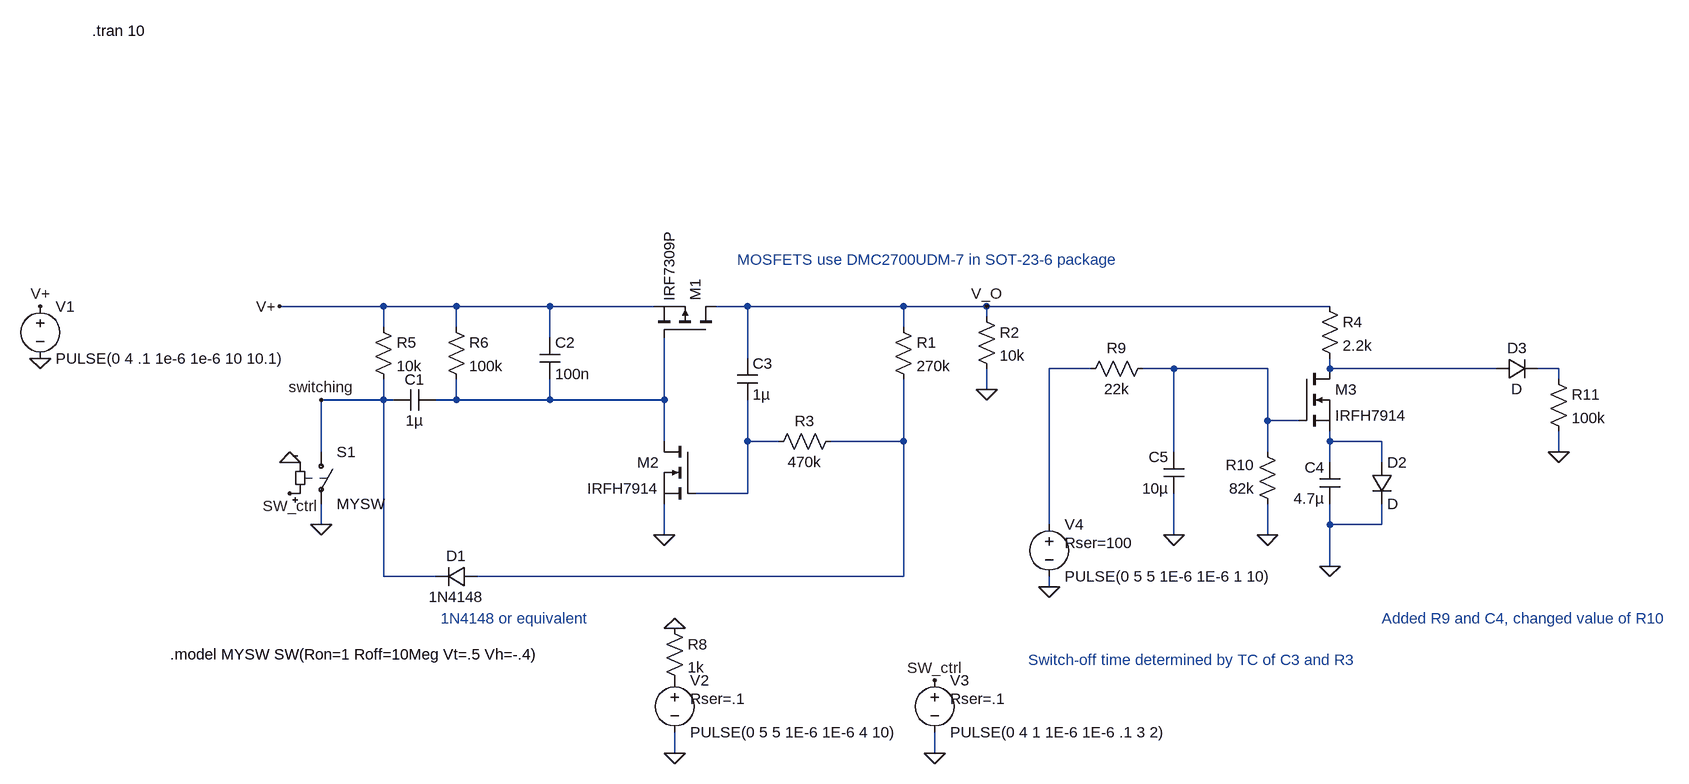
[diagram p0: schematic on_button_timing.asc]
on_button_timing.asc, the LTspice schematic file:
Version 4
SHEET 1 2168 680
WIRE 112 -576 -48 -576
WIRE 224 -576 112 -576
WIRE 368 -576 224 -576
WIRE 528 -576 368 -576
WIRE 672 -576 624 -576
WIRE 912 -576 672 -576
WIRE 1040 -576 912 -576
WIRE 1568 -576 1040 -576
WIRE 1040 -560 1040 -576
WIRE 112 -544 112 -576
WIRE 224 -544 224 -576
WIRE 912 -544 912 -576
WIRE 368 -528 368 -576
WIRE 672 -496 672 -576
WIRE 1200 -480 1136 -480
WIRE 1328 -480 1280 -480
WIRE 1472 -480 1328 -480
WIRE 1568 -480 1568 -496
WIRE 1824 -480 1568 -480
WIRE 1920 -480 1888 -480
WIRE 1920 -464 1920 -480
WIRE 1040 -448 1040 -480
WIRE 112 -432 112 -464
WIRE 112 -432 16 -432
WIRE 128 -432 112 -432
WIRE 224 -432 224 -464
WIRE 224 -432 192 -432
WIRE 368 -432 368 -464
WIRE 368 -432 224 -432
WIRE 544 -432 544 -528
WIRE 544 -432 368 -432
WIRE 1472 -400 1472 -480
WIRE 1520 -400 1472 -400
WIRE 544 -368 544 -432
WIRE 672 -368 672 -432
WIRE 720 -368 672 -368
WIRE 912 -368 912 -464
WIRE 912 -368 800 -368
WIRE 1568 -368 1568 -384
WIRE 1648 -368 1568 -368
WIRE 16 -352 16 -432
WIRE 1328 -352 1328 -480
WIRE 1472 -352 1472 -400
WIRE 1920 -352 1920 -384
WIRE 1568 -336 1568 -368
WIRE 1648 -336 1648 -368
WIRE 672 -288 672 -368
WIRE 672 -288 592 -288
WIRE 16 -240 16 -272
WIRE 1136 -240 1136 -480
WIRE 1568 -240 1568 -272
WIRE 1648 -240 1648 -272
WIRE 1648 -240 1568 -240
WIRE 544 -224 544 -272
WIRE 1328 -224 1328 -288
WIRE 1472 -224 1472 -272
WIRE 1568 -176 1568 -240
WIRE 112 -160 112 -432
WIRE 192 -160 112 -160
WIRE 912 -160 912 -368
WIRE 912 -160 256 -160
WIRE 1136 -144 1136 -160
WIRE 560 112 560 80
WIRE 960 112 960 80
FLAG 544 -224 0
FLAG -48 -576 V+
FLAG 1040 -576 V_O
FLAG 960 112 0
FLAG -416 -496 0
FLAG -416 -576 V+
FLAG 960 0 SW_ctrl
FLAG -32 -288 SW_ctrl
FLAG 1040 -448 0
FLAG -32 -336 0
FLAG 16 -240 0
FLAG 560 112 0
FLAG 16 -432 switching
FLAG 1568 -176 0
FLAG 1136 -144 0
FLAG 560 -80 0
FLAG 1472 -224 0
FLAG 1328 -224 0
FLAG 1920 -352 0
SYMBOL voltage 960 -16 R0
WINDOW 123 0 0 Left 2
WINDOW 39 24 44 Left 2
SYMATTR SpiceLine Rser=.1
SYMATTR InstName V3
SYMATTR Value PULSE(0 4 1 1E-6 1E-6 .1 3 2)
SYMBOL res 96 -560 R0
SYMATTR InstName R5
SYMATTR Value 10k
SYMBOL res 208 -560 R0
SYMATTR InstName R6
SYMATTR Value 100k
SYMBOL pmos 624 -528 M270
SYMATTR InstName M1
SYMATTR Value IRF7309P
SYMBOL nmos 592 -368 M0
SYMATTR InstName M2
SYMATTR Value IRFH7914
SYMBOL sw 16 -368 R0
SYMATTR InstName S1
SYMATTR Value MYSW
SYMBOL voltage -416 -592 R0
WINDOW 123 0 0 Left 2
WINDOW 39 0 0 Left 2
SYMATTR InstName V1
SYMATTR Value PULSE(0 4 .1 1e-6 1e-6 10 10.1)
SYMBOL res 896 -560 R0
SYMATTR InstName R1
SYMATTR Value 270k
SYMBOL cap 352 -528 R0
SYMATTR InstName C2
SYMATTR Value 100n
SYMBOL cap 192 -448 R90
WINDOW 0 0 32 VBottom 2
WINDOW 3 32 32 VTop 2
SYMATTR InstName C1
SYMATTR Value 1µ
SYMBOL cap 656 -496 R0
SYMATTR InstName C3
SYMATTR Value 1µ
SYMBOL res 816 -384 R90
WINDOW 0 0 56 VBottom 2
WINDOW 3 32 56 VTop 2
SYMATTR InstName R3
SYMATTR Value 470k
SYMBOL diode 256 -176 R90
WINDOW 0 0 32 VBottom 2
WINDOW 3 32 32 VTop 2
SYMATTR InstName D1
SYMATTR Value 1N4148
SYMBOL voltage 560 -16 R0
WINDOW 123 0 0 Left 2
WINDOW 39 24 44 Left 2
SYMATTR SpiceLine Rser=.1
SYMATTR InstName V2
SYMATTR Value PULSE(0 5 5 1E-6 1E-6 4 10)
SYMBOL nmos 1520 -480 R0
SYMATTR InstName M3
SYMATTR Value IRFH7914
SYMBOL res 1552 -592 R0
SYMATTR InstName R4
SYMATTR Value 2.2k
SYMBOL voltage 1136 -256 R0
WINDOW 123 0 0 Left 2
WINDOW 39 24 44 Left 2
SYMATTR SpiceLine Rser=100
SYMATTR InstName V4
SYMATTR Value PULSE(0 5 5 1E-6 1E-6 1 10)
SYMBOL res 544 -96 R0
SYMATTR InstName R8
SYMATTR Value 1k
SYMBOL res 1024 -576 R0
SYMATTR InstName R2
SYMATTR Value 10k
SYMBOL res 1488 -256 R180
WINDOW 0 36 76 Left 2
WINDOW 3 36 40 Left 2
SYMATTR InstName R10
SYMATTR Value 82k
SYMBOL cap 1584 -272 R180
WINDOW 0 24 56 Left 2
WINDOW 3 24 8 Left 2
SYMATTR InstName C4
SYMATTR Value 4.7µ
SYMBOL res 1296 -496 R90
WINDOW 0 0 56 VBottom 2
WINDOW 3 32 56 VTop 2
SYMATTR InstName R9
SYMATTR Value 22k
SYMBOL diode 1632 -336 R0
SYMATTR InstName D2
SYMBOL cap 1344 -288 R180
WINDOW 0 24 56 Left 2
WINDOW 3 24 8 Left 2
SYMATTR InstName C5
SYMATTR Value 10µ
SYMBOL diode 1824 -464 R270
WINDOW 0 32 32 VTop 2
WINDOW 3 0 32 VBottom 2
SYMATTR InstName D3
SYMBOL res 1904 -480 R0
SYMATTR InstName R11
SYMATTR Value 100k
TEXT -336 -1000 Left 2 !.tran 10
TEXT -216 -40 Left 2 !.model MYSW SW(Ron=1 Roff=10Meg Vt=.5 Vh=-.4)
TEXT 656 -648 Left 2 ;MOSFETS use DMC2700UDM-7 in SOT-23-6 package
TEXT 1104 -32 Left 2 ;Switch-off time determined by TC of C3 and R3
TEXT 200 -96 Left 2 ;1N4148 or equivalent
TEXT 1648 -96 Left 2 ;Added R9 and C4, changed value of R10

The netlist it stands for:
* on_button_timing.asc
V3 SW_ctrl 0 PULSE(0 4 1 1E-6 1E-6 .1 3 2) Rser=.1
R5 V+ switching 10k
R6 V+ N005 100k
M1 V_O N005 V+ V+ IRF7309P
M2 N005 N006 0 0 IRFH7914
S1 switching 0 SW_ctrl 0 MYSW
V1 V+ 0 PULSE(0 4 .1 1e-6 1e-6 10 10.1)
R1 V_O N007 270k
C2 V+ N005 100n
C1 N005 switching 1µ
C3 V_O N006 1µ
R3 N007 N006 470k
D1 N007 switching 1N4148
V2 P001 0 PULSE(0 5 5 1E-6 1E-6 4 10) Rser=.1
M3 N003 N002 N008 N008 IRFH7914
R4 V_O N003 2.2k
V4 N001 0 PULSE(0 5 5 1E-6 1E-6 1 10) Rser=100
R8 0 P001 1k
R2 V_O 0 10k
R10 0 N002 82k
C4 0 N008 4.7µ
R9 N002 N001 22k
D2 N008 0 D
C5 0 N002 10µ
D3 N003 N004 D
R11 N004 0 100k
.model D D
.lib standard.dio
.model NMOS NMOS
.model PMOS PMOS
.lib standard.mos
.tran 10
.model MYSW SW(Ron=1 Roff=10Meg Vt=.5 Vh=-.4)
* MOSFETS use DMC2700UDM-7 in SOT-23-6 package
* Switch-off time determined by TC of C3 and R3
* 1N4148 or equivalent
* Added R9 and C4, changed value of R10
.backanno
.end